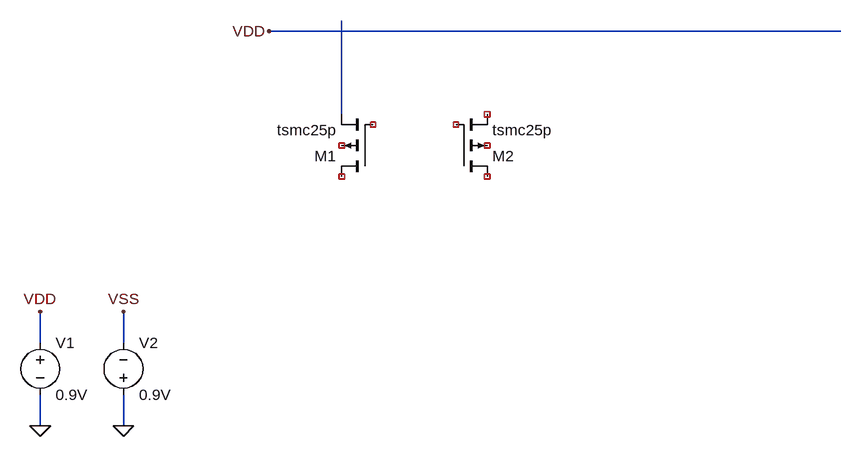
[diagram p0: schematic Draft1.asc]
Draft1.asc, the LTspice schematic file:
Version 4
SHEET 1 1204 680
WIRE 1200 -368 320 -368
WIRE 432 -240 432 -384
WIRE -32 112 -32 64
WIRE 96 112 96 64
WIRE -32 240 -32 192
WIRE 96 240 96 192
FLAG -32 240 0
FLAG 96 240 0
FLAG -32 64 VDD
FLAG 96 64 VSS
FLAG 320 -368 VDD
SYMBOL voltage -32 96 R0
WINDOW 123 0 0 Left 0
WINDOW 39 0 0 Left 0
SYMATTR InstName V1
SYMATTR Value 0.9V
SYMBOL voltage 96 208 M180
WINDOW 0 24 96 Left 2
WINDOW 3 24 16 Left 2
WINDOW 123 0 0 Left 0
WINDOW 39 0 0 Left 0
SYMATTR InstName V2
SYMATTR Value 0.9V
SYMBOL pmos4 480 -144 R180
SYMATTR InstName M1
SYMATTR Value tsmc25p
SYMBOL pmos4 608 -144 M180
SYMATTR InstName M2
SYMATTR Value tsmc25p

The netlist it stands for:
* Draft1.asc
V1 VDD 0 0.9V
V2 0 VSS 0.9V
M1 NC_01 NC_02 N001 NC_03 tsmc25p
M2 NC_04 NC_05 NC_06 NC_07 tsmc25p
.model NMOS NMOS
.model PMOS PMOS
.lib standard.mos
.backanno
.end